# EAGLE design hc908_v7 (EAGLE 4.16)
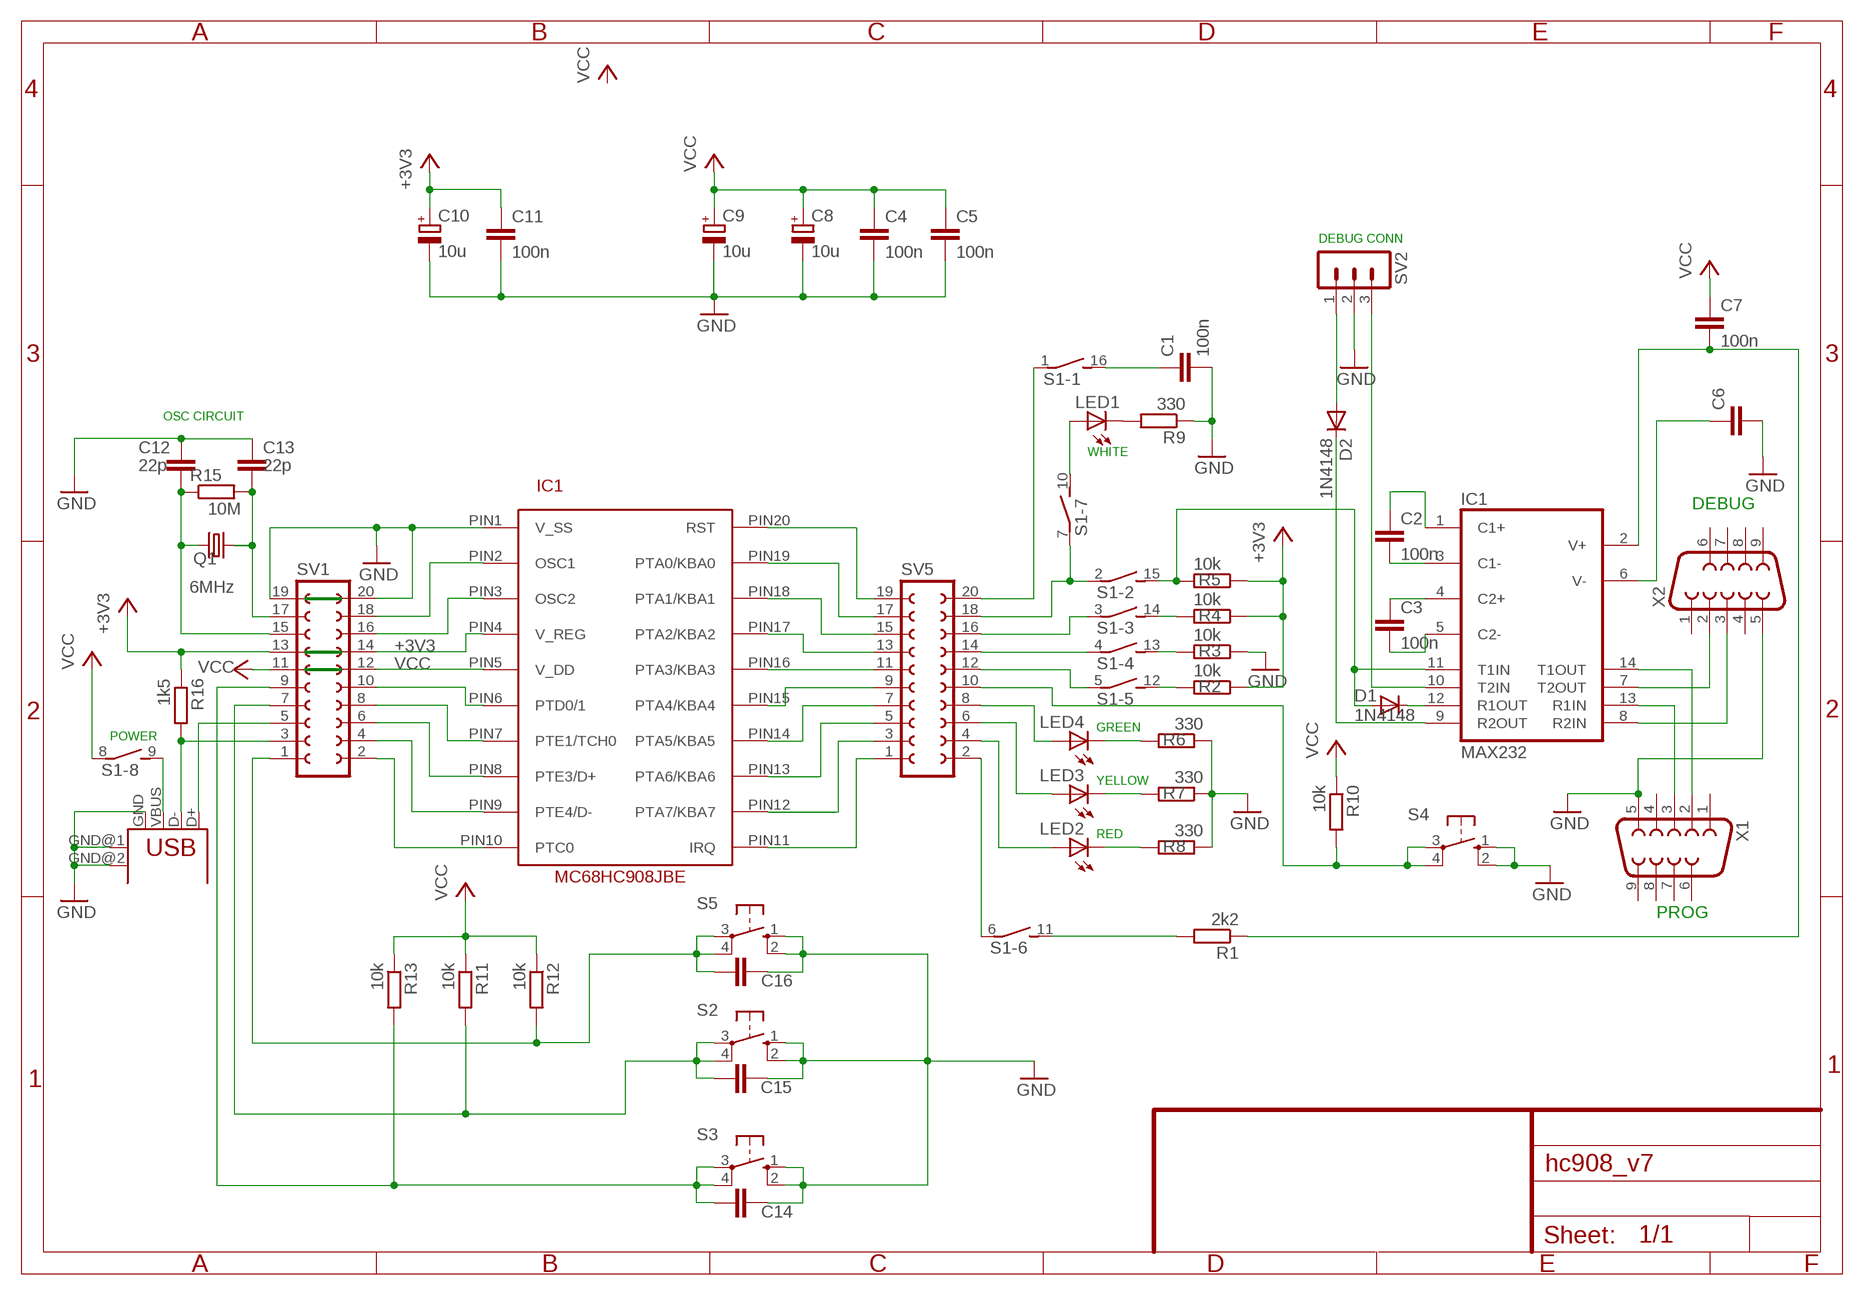
[diagram p0: schematic, sheet 1]

## Parts
C1  100n  C-EU025-024X044  [C025-024X044]
C2  100n  C-EU025-024X044  [C025-024X044]
C3  100n  C-EU025-024X044  [C025-024X044]
C4  100n  C-EU025-024X044  [C025-024X044]
C5  100n  C-EU025-024X044  [C025-024X044]
C6  C-EU025-024X044  [C025-024X044]
C7  100n  C-EU025-024X044  [C025-024X044]
C8  10u  CPOL-EUE2,5-6E  [E2,5-6E]
C9  10u  CPOL-EUE2,5-6E  [E2,5-6E]
C10  10u  CPOL-EUE2,5-6E  [E2,5-6E]
C11  100n  C-EU025-024X044  [C025-024X044]
C12  22p  C-EU025-024X044  [C025-024X044]
C13  22p  C-EU025-024X044  [C025-024X044]
C14  C-EU025-024X044  [C025-024X044]
C15  C-EU025-024X044  [C025-024X044]
C16  C-EU025-024X044  [C025-024X044]
D1  1N4148  [DO35-10]
D2  1N4148  [DO35-10]
IC1  MAX232  [DIL16]
LED1  LED3MM  [LED3MM]
LED2  LED3MM  [LED3MM]
LED3  LED3MM  [LED3MM]
LED4  LED3MM  [LED3MM]
Q1  6MHz  CRYSTALHC49S  [HC49/S]
R1  2k2  R-EU_0204/5  [0204/5]
R2  10k  R-EU_0207/12  [0207/12]
R3  10k  R-EU_0204/5  [0204/5]
R4  10k  R-EU_0204/7  [0204/7]
R5  10k  R-EU_0204/5  [0204/5]
R6  330  R-EU_0204/5  [0204/5]
R7  330  R-EU_0204/5  [0204/5]
R8  330  R-EU_0204/5  [0204/5]
R9  330  R-EU_0204/5  [0204/5]
R10  10k  R-EU_0204/5  [0204/5]
R11  10k  R-EU_0204/5  [0204/5]
R12  10k  R-EU_0204/5  [0204/5]
R13  10k  R-EU_0204/5  [0204/5]
R15  10M  R-EU_0204/5  [0204/5]
R16  1k5  R-EU_0207/12  [0207/12]
S1  DIP08S  [DIP08S]
S2  10-XX  [B3F-10XX]
S3  10-XX  [B3F-10XX]
S4  10-XX  [B3F-10XX]
S5  10-XX  [B3F-10XX]
SV1  FE10-2  [FE10-2]
SV2  MA03-1  [MA03-1]
SV5  FE10-2  [FE10-2]
U$1  MC68HC908JB8EPDIP-20  [PDIP-20]
USB1  USB-B-H  [USB-B-H]
X1  F09H  [F09H]
X2  F09H  [F09H]

## Nets
+3V3: C10.+ C11.1 R2.1 R4.1 R5.1 R16.1 SV1.13 SV1.14 U$1.PIN4(V_REG)
GND: C1.2 C4.2 C5.2 C6.2 C8.- C9.- C10.- C11.2 C12.1 C13.1 C14.2 C15.1 C16.2 R3.1 R6.1 R7.1 R8.1 R9.1 S2.1(S) S2.2(S1) S3.1(S) S3.2(S1) S4.1(S) S4.2(S1) S5.1(S) S5.2(S1) SV1.19 SV1.20 SV2.2 U$1.PIN1(V_SS) USB1.GND USB1.GND@1(GND) USB1.GND@2(GND) X1.5 X2.5
N$1: D1.C IC1.12(R1OUT)
N$2: SV1.2 U$1.PIN10(PTC0)
N$3: IC1.13(R1IN) X1.3
N$4: IC1.14(T1OUT) X1.2
N$5: SV5.1 U$1.PIN11(IRQ)
N$6: SV5.3 U$1.PIN12(PTA7/KBA7)
N$7: SV5.5 U$1.PIN13(PTA6/KBA6)
N$8: SV5.7 U$1.PIN14(PTA5/KBA5)
N$9: SV5.9 U$1.PIN15(PTA4/KBA4)
N$10: SV5.11 U$1.PIN16(PTA3/KBA3)
N$11: SV5.13 U$1.PIN17(PTA2/KBA2)
N$12: SV5.15 U$1.PIN18(PTA1/KBA1)
N$13: SV5.17 U$1.PIN19(PTA0/KBA0)
N$14: SV5.19 U$1.PIN20(RST)
N$15: S1.1 SV5.20
N$16: D1.A IC1.11(T1IN) R5.2 S1.15
N$17: S1.3 SV5.16
N$18: S1.4 SV5.14
N$19: S1.5 SV5.12
N$20: S1.6 SV5.2
N$21: C1.1 S1.16
N$22: LED1.K(C) R9.2
N$23: R4.2 S1.14
N$24: R3.2 S1.13
N$25: R2.2 S1.12
N$26: R1.2 S1.11
N$27: C7.2 IC1.2(V+) R1.1
N$29: SV1.4 U$1.PIN9(PTE4/D-)
N$30: SV1.6 U$1.PIN8(PTE3/D+)
N$31: SV1.8 U$1.PIN7(PTE1/TCH0)
N$32: SV1.10 U$1.PIN6(PTD0/1)
N$34: IC1.7(T2OUT) X2.2
N$35: SV1.16 U$1.PIN3(OSC2)
N$36: SV1.18 U$1.PIN2(OSC1)
N$37: C12.2 Q1.2 R15.1 SV1.15
N$38: C13.2 Q1.1 R15.2 SV1.17
N$39: C6.1 IC1.6(V-)
N$40: C2.2 IC1.3(C1-)
N$41: C2.1 IC1.1(C1+)
N$42: C3.1 IC1.4(C2+)
N$43: SV1.5 USB1.D+
N$44: R16.2 SV1.3 USB1.D-
N$45: C3.2 IC1.5(C2-)
N$46: S1.9 USB1.VBUS
N$47: S1.2 S1.7 SV5.18
N$48: LED1.A S1.10
N$49: LED2.K(C) R8.2
N$50: LED3.K(C) R7.2
N$51: LED4.K(C) R6.2
N$52: LED2.A SV5.4
N$53: LED3.A SV5.6
N$54: LED4.A SV5.8
N$55: R10.2 S4.3(P) S4.4(P1) SV5.10
N$56: C16.1 R12.2 S5.3(P) S5.4(P1) SV1.1
N$57: IC1.8(R2IN) X2.3
N$58: IC1.10(T2IN) SV2.3
N$59: D2.C IC1.9(R2OUT)
N$60: C14.1 R13.2 S3.3(P) S3.4(P1) SV1.9
N$61: C15.2 R11.2 S2.3(P) S2.4(P1) SV1.7
N$62: D2.A SV2.1
VCC: C4.1 C5.1 C7.1 C8.+ C9.+ R10.1 R11.1 R12.1 R13.1 S1.8 SV1.11 SV1.12 U$1.PIN5(V_DD)
Unconnected: X1.1 X1.4 X1.6 X1.7 X1.8 X1.9 X2.1 X2.4 X2.6 X2.7 X2.8 X2.9

## Notes on the sheet
- DEBUG CONN
- OSC CIRCUIT
- WHITE
- DEBUG
- GREEN
- POWER
- YELLOW
- RED
- PROG

## Power pins joined to a net without a drawn wire
GND: IC1.15(GND)
VCC: IC1.16(VCC)

## Library data of the parts
C1-C7 C11-C16 = rcl:C-EU: CAPACITOR, European symbol
C8-C10 = rcl:CPOL-EU: POLARIZED CAPACITOR, European symbol
D1 D2 = diode:1N4148: DIODE high speed (Philips)
IC1 = maxim:MAX232: RS232 TRANSEIVER
LED1-LED4 = led:LED: LED OSRAM: - CHIPLED LG R971, LG N971, LY N971, LG Q971, LY Q971, LO R971, LY R971 LH N974, LH R974 LS Q976, LO Q976, LY Q976 LO Q996 - Hyper CHIPLED LW Q18S LB Q993, LB Q99A, LB R99A - SideLED LS A670, LO A670, LY A670, LG A670, LP A670 LB A673, LV A673, LT A673, LW A673 LH A674 LY A675 LS A676, LA A676, LO A676, LY A676, LW A676 LS A679, LY A679, LG A679 - Hyper Micro SIDELED® LS Y876, LA Y876, LO Y876, LY Y876 LT Y87S - SmartLED LW L88C, LW L88S LB L89C, LB L89S, LG L890 LS L89K, LO L89K, LY L89K LS L896, LA L896, LO L896, LY L896 - TOPLED LS T670, LO T670, LY T670, LG T670, LP T670 LSG T670, LSP T670, LSY T670, LOP T670, LYG T670 LG T671, LOG T671, LSG T671 LB T673, LV T673, LT T673, LW T673 LH T674 LS T676, LA T676, LO T676, LY T676, LB T676, LH T676, LSB T676, LW T676 LB T67C, LV T67C, LT T67C, LS T67K, LO T67K, LY T67K, LW E67C LS E67B, LA E67B, LO E67B, LY E67B, LB E67C, LV E67C, LT E67C LW T67C LS T679, LY T679, LG T679 LS T770, LO T770, LY T770, LG T770, LP T770 LB T773, LV T773, LT T773, LW T773 LH T774 LS E675, LA E675, LY E675, LS T675 LS T776, LA T776, LO T776, LY T776, LB T776 LHGB T686 LT T68C, LB T68C - Hyper Mini TOPLED® LB M676 - Mini TOPLED Santana® LG M470 LS M47K, LO M47K, LY M47K Source: http://www.osram.convergy.de - LUMILED® LXK2-PW12-R00, LXK2-PW12-S00, LXK2-PW14-U00, LXK2-PW14-V00 LXK2-PM12-R00, LXK2-PM12-S00, LXK2-PM14-U00 LXK2-PE12-Q00, LXK2-PE12-R00, LXK2-PE12-S00, LXK2-PE14-T00, LXK2-PE14-U00 LXK2-PB12-K00, LXK2-PB12-L00, LXK2-PB12-M00, LXK2-PB14-N00, LXK2-PB14-P00, LXK2-PB14-Q00 LXK2-PR12-L00, LXK2-PR12-M00, LXK2-PR14-Q00, LXK2-PR14-R00 LXK2-PD12-Q00, LXK2-PD12-R00, LXK2-PD12-S00 LXK2-PH12-R00, LXK2-PH12-S00 LXK2-PL12-P00, LXK2-PL12-Q00, LXK2-PL12-R00 Source: www.luxeon.com
Q1 = crystal:CRYSTAL: CRYSTAL
R1-R13 R15 R16 = rcl:R-EU_: RESISTOR, European symbol
S1 = switch-dil:DIP08S: DIL/CODE SWITCH
S2-S5 = switch-omron:10-XX: OMRON SWITCH
SV1 SV5 = con-lsta:FE10-2: FEMALE HEADER
SV2 = con-lstb:MA03-1: PIN HEADER
U$1 = freescale-mc68hc908jb:MC68HC908JB8E
USB1 = con-usb-2:USB: USB Connectors
X1 X2 = con-subd:F09: SUB-D

## Board
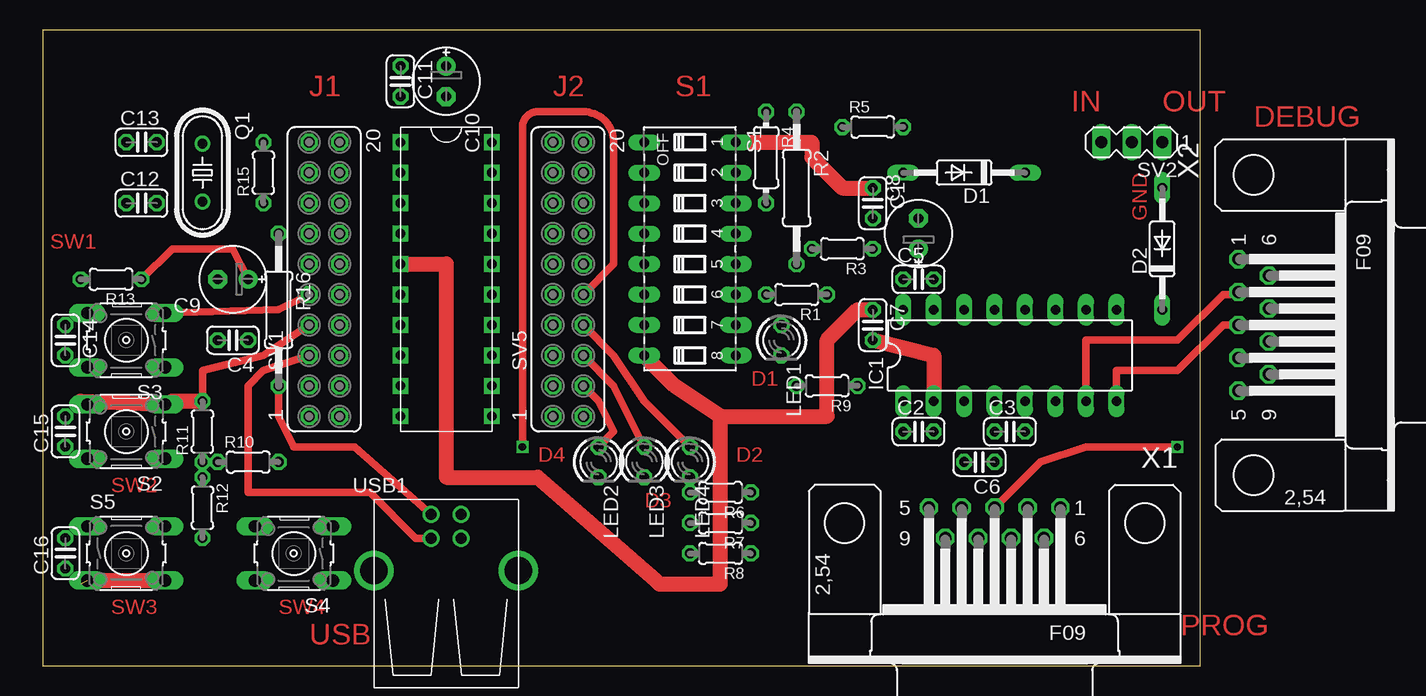
[diagram p1: board, top side]
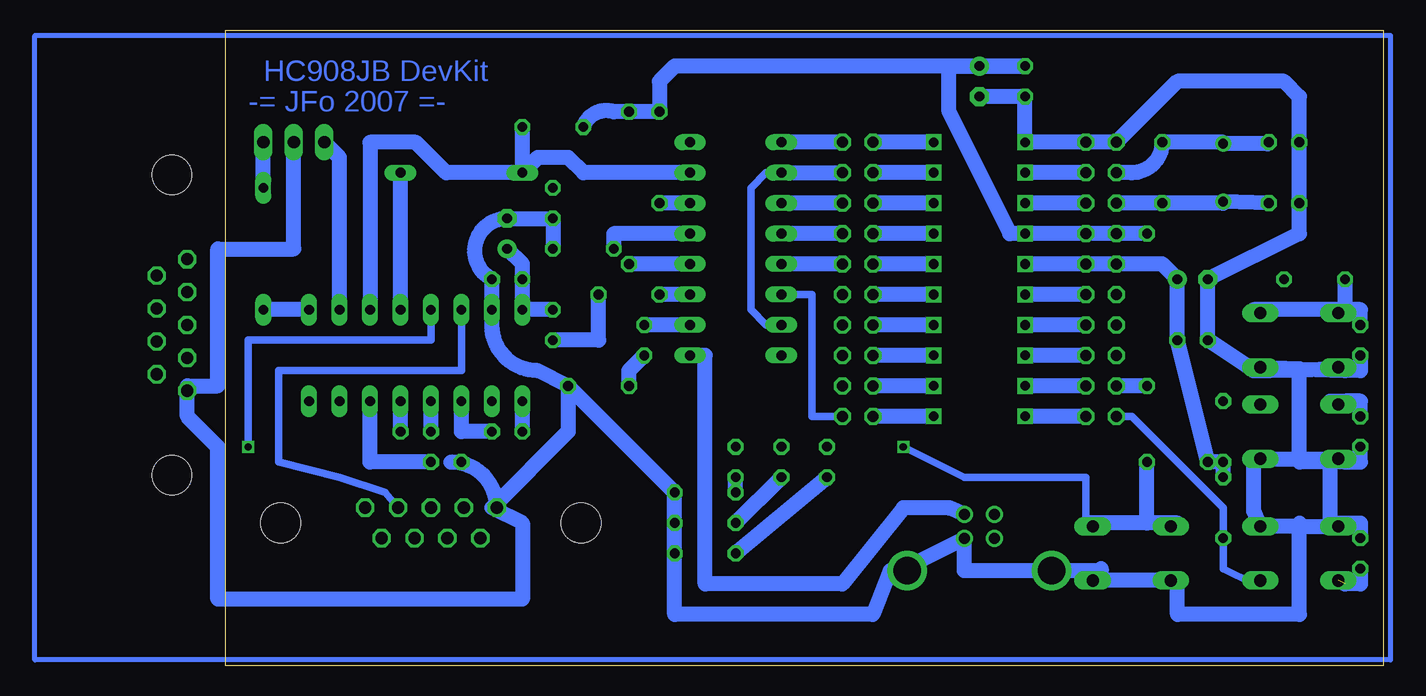
[diagram p2: board, bottom side, seen from below]

Size 96.5 x 53.01 mm. Coordinates in mm from the lower left corner, seen from the top.
Outline: 0,0 96.5,0 96.5,53.01 0,53.01 0,0
Copper layers (1*16): Top 0.035mm / dielectric 1.5mm / Bottom 0.035mm
Design rules "default": minimum track width 12mil, minimum drill 24mil, track to track 30mil, track to pad 30mil, pad to pad 30mil, via to via 30mil, smd to smd 8mil, copper to edge 40mil, drill to drill 8mil, minimum pad ring 10mil, minimum via ring 8mil, stop-mask expansion 4mil, vias tented up to drill 0mil, thermal gap 10mil

### Footprints (pad centres in the part's own frame; a part is rotated, then mirrored left to right if it is on the bottom)
C025-024X044 = drill 0.813 octagon: 1 -1.27,0; 2 1.27,0
E2,5-6E = drill 0.813 pad 1.575 round: + -1.27,0 | drill 0.813 pad 1.575 octagon: - 1.27,0
DO35-10 = drill 0.813 long: A 5.08,0; C -5.08,0
DIL16 = drill 0.813 long: 1 -8.89,-3.81; 2 -6.35,-3.81; 3 -3.81,-3.81; 4 -1.27,-3.81; 5 1.27,-3.81; 6 3.81,-3.81; 7 6.35,-3.81; 8 8.89,-3.81; 9 8.89,3.81; 10 6.35,3.81; 11 3.81,3.81; 12 1.27,3.81; 13 -1.27,3.81; 14 -3.81,3.81; 15 -6.35,3.81; 16 -8.89,3.81
LED3MM = drill 0.813 octagon: A -1.27,0; K 1.27,0
HC49/S = drill 0.813 round: 1 -2.413,0; 2 2.413,0
0204/5 = drill 0.813 octagon: 1 -2.54,0; 2 2.54,0
0207/12 = drill 0.813 octagon: 1 -6.35,0; 2 6.35,0
0204/7 = drill 0.813 octagon: 1 -3.81,0; 2 3.81,0
DIP08S = drill 0.813 long: 1 -8.89,-3.81; 2 -6.35,-3.81; 3 -3.81,-3.81; 4 -1.27,-3.81; 5 1.27,-3.81; 6 3.81,-3.81; 7 6.35,-3.81; 8 8.89,-3.81; 9 8.89,3.81; 10 6.35,3.81; 11 3.81,3.81; 12 1.27,3.81; 13 -1.27,3.81; 14 -3.81,3.81; 15 -6.35,3.81; 16 -8.89,3.81
B3F-10XX = drill 1.016 long: 1 -3.251,2.261; 2 3.251,2.261; 3 -3.251,-2.261; 4 3.251,-2.261
FE10-2 = drill 0.914 octagon: 1 -11.43,1.27; 2 -11.43,-1.27; 3 -8.89,1.27; 4 -8.89,-1.27; 5 -6.35,1.27; 6 -6.35,-1.27; 7 -3.81,1.27; 8 -3.81,-1.27; 9 -1.27,1.27; 10 -1.27,-1.27; 11 1.27,1.27; 12 1.27,-1.27; 13 3.81,1.27; 14 3.81,-1.27; 15 6.35,1.27; 16 6.35,-1.27; 17 8.89,1.27; 18 8.89,-1.27; 19 11.43,1.27; 20 11.43,-1.27
MA03-1 = drill 1.016 long: 1 -2.54,0; 2 0,0; 3 2.54,0
PDIP-20 = drill 0.8 square: PIN1 -3.81,11.43; PIN2 -3.81,8.89; PIN3 -3.81,6.35; PIN4 -3.81,3.81; PIN5 -3.81,1.27; PIN6 -3.81,-1.27; PIN7 -3.81,-3.81; PIN8 -3.81,-6.35; PIN9 -3.81,-8.89; PIN10 -3.81,-11.43; PIN11 3.81,-11.43; PIN12 3.81,-8.89; PIN13 3.81,-6.35; PIN14 3.81,-3.81; PIN15 3.81,-1.27; PIN16 3.81,1.27; PIN17 3.81,3.81; PIN18 3.81,6.35; PIN19 3.81,8.89; PIN20 3.81,11.43
USB-B-H = drill 0.914 round: D+ 0,1.25; D- 1.981,1.25; GND 0,-1.25; VBUS 1.981,-1.25 | drill 2.286 round: GND@1 -2.718,6.02; GND@2 -2.718,-6.02
F09H = drill 1.016 octagon: 1 -5.486,-1.27; 2 -2.743,-1.27; 3 0,-1.27; 4 2.743,-1.27; 5 5.486,-1.27; 6 -4.115,1.27; 7 -1.372,1.27; 8 1.372,1.27; 9 4.115,1.27 | hole 3.302: -12.522,0; 12.522,0

### Placement (x,y rotation side)
C1  69.21,38.57 270 top
C2  73.02,19.52 0 top
C3  80.64,19.52 0 top
C4  15.87,27.14 180 top
C5  73.02,32.22 0 top
C6  78.1,16.98 180 top
C7  69.21,28.41 270 top
C8  73.02,36.03 90 top
C9  15.87,32.22 180 top
C10  33.65,48.73 270 top
C11  29.84,48.73 270 top
C12  8.25,38.57 0 top
C13  8.25,43.65 0 top
C14  1.9,27.14 270 top
C15  1.9,19.52 90 top
C16  1.9,9.36 90 top
D1  76.83,41.11 180 top
D2  93.34,34.76 90 top
IC1  80.64,25.87 0 top
LED1  61.59,27.14 270 top
LED2  46.35,16.98 270 top
LED3  50.16,16.98 270 top
LED4  53.97,16.98 270 top
Q1  13.33,41.11 270 top
R1  62.86,30.95 180 top
R2  62.86,39.84 270 top
R3  66.67,34.76 180 top
R4  60.32,42.38 270 top
R5  69.21,44.92 0 top
R6  56.51,14.44 180 top
R7  56.51,11.9 180 top
R8  56.51,9.36 180 top
R9  65.4,23.33 180 top
R10  17.14,16.98 0 top
R11  13.33,19.52 90 top
R12  13.33,13.17 270 top
R13  5.71,32.22 180 top
R15  18.41,41.11 90 top
R16  19.68,29.68 270 top
S1  53.97,34.76 270 top
S2  6.98,19.52 180 top
S3  6.98,27.14 180 top
S4  20.95,9.36 180 top
S5  6.98,9.36 0 top
SV1  23.49,32.22 90 top
SV2  90.8,43.65 180 top
SV5  43.81,32.22 90 top
U$1  33.65,32.22 0 top
USB1  33.65,10.63 90 top
X1  79.37,11.9 180 top
X2  100.96,28.41 270 top  (outside the outline)

### Tracks (layer width: path | path; a pad name or v marks a point on that pad's centre or on a via)
+3V3
  Bottom 1.27: R16.1 SV1.13 SV1.14 U$1.PIN4 31.11,36.03 36.19,46.19 36.19,50 C11.1 C10.+ 59.05,50 60.32,48.73 R4.1 R2.1 64.13,46.19 arc-90 R5.1
GND
  Bottom 0.406: S4.1 23.49,8.09 | 10.79,16.98 S2.1
  Bottom 1.27: C10.- C11.2 U$1.PIN1 SV1.20 SV1.19 17.14,48.73 8.25,48.73 6.98,47.46 C13.1 C12.1 6.98,36.03 C9.- C4.2 10.79,24.6 | 10.79,24.6 9.52,24.6 | 6.97,24.75 3.17,24.6 1.9,24.6 C14.2 | 6.97,24.75 S3.1 | 6.98,24.6 6.97,24.75 | 6.98,24.6 S3.2 | 6.98,24.6 10.79,24.6 | 6.98,24.6 6.98,16.98 3.17,16.98 | S2.2 S2.1 10.79,17.26 10.79,16.98 10.79,12.89 | S2.2 3.17,17.26 3.17,16.98 | S2.2 4.44,17.26 4.44,11.9 1.9,11.9 C16.2 | 6.98,11.62 S5.1 | 6.98,11.62 S5.2 10.79,12.89 | 10.79,12.89 10.79,13.17 | 23.49,8.09 23.49,7.91 USB1.GND@1 34.92,7.91 34.92,10.63 | S4.1 S4.2 17.14,7.1 17.14,4.28 6.98,4.28 6.98,11.62 | 6.98,11.62 6.98,11.9 | 41.09,7.91 40,8.09 34.92,10.63 | 41.09,7.91 USB1.GND@2 | 34.92,10.63 USB1.GND | R9.1 R6.1 R7.1 R8.1 59.05,4.28 42.54,4.28 41.09,7.91 | R9.1 67.94,19.52 74.29,13.17 | C6.2 77.69,16.98 arc90 X1.5 74.29,13.17 | R3.1 C1.2 C8.- arc-152 C5.2 IC1.15 74.29,28.41 arc-90 70.48,24.6 R9.1 | 74.29,13.17 71.75,11.9 71.75,5.55 97.15,5.55 97.15,18.25 99.69,20.79 X2.5 99.69,23.33 97.15,23.33 97.15,34.76 90.8,34.76 SV2.2 | C15.1 1.9,16.98 3.17,16.98
N$1
  Bottom 1.27: IC1.12 D1.C
N$2
  Bottom 1.27: SV1.2 U$1.PIN10
N$3  (via drill 0.6)
  Top 0.61: X1.3 83.18,16.98 86.99,18.25 v94.61,18.25
  Bottom 0.61: v94.61,18.25 94.61,27.14 79.37,27.14 IC1.13
N$4
  Bottom 0.61: X1.2 83.18,14.44 86.99,15.71 92.07,16.98 92.07,24.6 76.83,24.6 IC1.14
N$5
  Bottom 1.27: U$1.PIN11 SV5.1
N$6
  Bottom 1.27: U$1.PIN12 SV5.3
N$7
  Bottom 1.27: U$1.PIN13 SV5.5
N$8
  Bottom 1.27: U$1.PIN14 SV5.7
N$9
  Bottom 1.27: U$1.PIN15 SV5.9
N$10
  Bottom 1.27: U$1.PIN16 SV5.11
N$11
  Bottom 1.27: U$1.PIN17 SV5.13
N$12
  Bottom 1.27: U$1.PIN18 SV5.15
N$13
  Bottom 1.27: U$1.PIN19 SV5.17
N$14
  Bottom 1.27: U$1.PIN20 SV5.19
N$15
  Bottom 1.27: SV5.20 S1.1
N$16
  Bottom 1.27: D1.A R5.2 | D1.A 78.1,41.11 80.64,43.65 84.45,43.65 IC1.11 | S1.15 66.67,41.11 67.94,42.38 70.48,42.38 D1.A
N$17
  Bottom 1.27: SV5.16 S1.3
N$18
  Bottom 1.27: SV5.14 S1.4
N$19
  Bottom 1.27: SV5.12 S1.5
N$20
  Bottom 0.61: SV5.2 47.62,20.79 47.62,30.95 S1.6
N$21
  Top 1.27: S1.16 64.13,43.65 64.13,42.38 66.67,39.84 C1.1
N$22
  Bottom 1.27: R9.2 62.86,24.6 LED1.K
N$23
  Bottom 1.27: S1.14 R4.2
N$24
  Bottom 1.27: S1.13 64.13,36.03 R3.2
N$25
  Bottom 1.27: S1.12 R2.2
N$26
  Bottom 1.27: S1.11 R1.2
N$27
  Top 1.27: IC1.2 74.29,25.87 C7.2
  Bottom 1.27: R1.1 65.4,27.14 C7.2
N$28
  Bottom 0.406: -0.64,0.47 -0.64,52.54 112.39,52.54 112.39,0.47 -0.64,0.47
N$29
  Bottom 1.27: SV1.4 U$1.PIN9
N$30
  Bottom 1.27: SV1.6 U$1.PIN8
N$31
  Bottom 1.27: SV1.8 U$1.PIN7
N$32
  Bottom 1.27: SV1.10 U$1.PIN6
N$34
  Top 0.61: IC1.7 86.99,27.14 94.61,27.14 98.42,30.95 99.69,30.95 X2.2
N$35
  Bottom 1.27: SV1.16 U$1.PIN3
N$36
  Bottom 1.27: SV1.18 U$1.PIN2
N$37
  Bottom 1.27: SV1.15 R15.1 13.33,38.57 Q1.2 C12.2
N$38
  Bottom 1.27: SV1.17 20.95,41.11 arc-90 R15.2 13.33,43.65 Q1.1 9.65,43.52 arc-90 C13.2
N$39
  Bottom 1.27: C6.1 84.45,16.98 IC1.6
N$40
  Bottom 1.27: C2.2 76.83,19.52 IC1.3
N$41
  Bottom 1.27: C2.1 IC1.1
N$42
  Bottom 1.27: C3.1 IC1.4
N$43
  Top 0.61: SV1.5 18.41,24.6 17.14,23.33 17.14,14.44 27.3,14.44 31.11,10.63 USB1.D+
N$44
  Top 0.61: USB1.D- 26.03,18.25 20.95,18.25 19.68,20.79 R16.2
  Bottom 1.27: R16.2 SV1.3
N$45
  Bottom 1.27: C3.2 IC1.5
N$46
  Bottom 1.27: S1.9 56.51,25.87 56.51,6.82 45.08,6.82 40,13.17 36.19,13.17 36.17,13.15 USB1.VBUS
N$47
  Bottom 0.61: S1.7 51.43,28.41 52.7,29.68 52.7,39.84 51.43,41.11 S1.2
  Bottom 1.27: S1.2 SV5.18
N$48
  Bottom 1.27: S1.10 LED1.A
N$49
  Bottom 1.27: R8.2 LED2.K
N$50
  Bottom 1.27: R7.2 LED3.K
N$51
  Bottom 1.27: R6.2 LED4.K
N$52
  Top 0.61: LED2.A 47.62,19.52 46.35,22.06 SV5.4
N$53
  Top 0.61: LED3.A 47.62,23.33 SV5.6
N$54
  Top 0.61: SV5.8 47.62,25.87 50.16,22.06 LED4.A
N$55  (via drill 0.6)
  Top 0.61: SV5.10 47.62,33.49 47.62,43.65 arc90 45.08,46.19 41.27,46.19 arc90 40,44.92 v40,18.25
  Bottom 0.406: S4.4 17.14,11.9
  Bottom 0.61: v40,18.25 34.92,15.71 24.76,15.71 24.76,11.9
  Bottom 1.27: 19.68,11.9 R10.2 | 19.68,11.9 24.76,11.9 | S4.3 23.92,11.9 19.68,11.9 | 17.14,11.9 19.68,11.9
N$56  (1 unrouted)
  Top 1.27: S5.3 S5.4
  Bottom 0.61: SV1.1 20.95,20.79 13.33,13.17 R12.2 13.33,8.09 10.79,6.82 arc90 10.51,7.1 S5.4
  Bottom 1.27: C16.1 1.9,6.82 3.17,6.82
N$57
  Top 0.61: IC1.8 89.53,24.6 94.61,24.6 98.42,28.41 X2.3
N$58
  Bottom 1.27: IC1.10 86.99,42.38 SV2.3
N$59
  Bottom 1.27: IC1.9 D2.C
N$60
  Top 0.61: S3.3 19.68,29.68 SV1.9
  Bottom 0.406: 10.79,29.68 S3.3
  Bottom 1.27: 3.17,29.68 R13.2 | 3.17,29.68 S3.4 | 4.44,29.68 3.17,29.68 | 4.44,29.68 10.79,29.68 | C14.1 1.9,29.68 4.44,29.68
N$61
  Top 0.406: S2.4 3.17,22.06 | S2.3 10.79,21.78 10.79,22.06
  Top 0.61: R11.2 13.33,24.6 18.41,25.87 SV1.7
  Top 1.27: 3.17,22.06 S2.3 | 10.79,22.06 R11.2
  Bottom 1.27: C15.2 1.9,22.06 3.17,22.06 4.44,22.06
N$62
  Bottom 1.27: D2.A SV2.1
VCC
  Top 0.61: R13.1 10.79,34.76 15.87,34.76 C9.+
  Top 1.27: C7.1 67.94,29.68 65.4,27.14 65.4,20.79 56.51,20.79 | 56.51,20.79 52.7,23.33 S1.8 | U$1.PIN5 33.65,33.49 33.65,15.71 41.27,15.71 51.43,6.82 56.51,6.82 56.51,20.79
  Bottom 1.27: U$1.PIN5 SV1.12 SV1.11 18.41,33.49 C9.+ C4.1 R10.1 R11.1 R12.1 | C7.1 IC1.16 C5.1 71.75,33.49 C8.+

### Text on the board
Top: J1 | J2 | S1 | IN | OUT | DEBUG | GND | SW1 | D1 | D4 | D2 | SW2 | D3 | SW3 | SW4 | PROG | USB
Bottom: HC908JB DevKit | -= JFo 2007 =-